# Altium schematic sheet LEDs.SchDoc
size A3; SheetNumber: 1; SheetTotal: 2
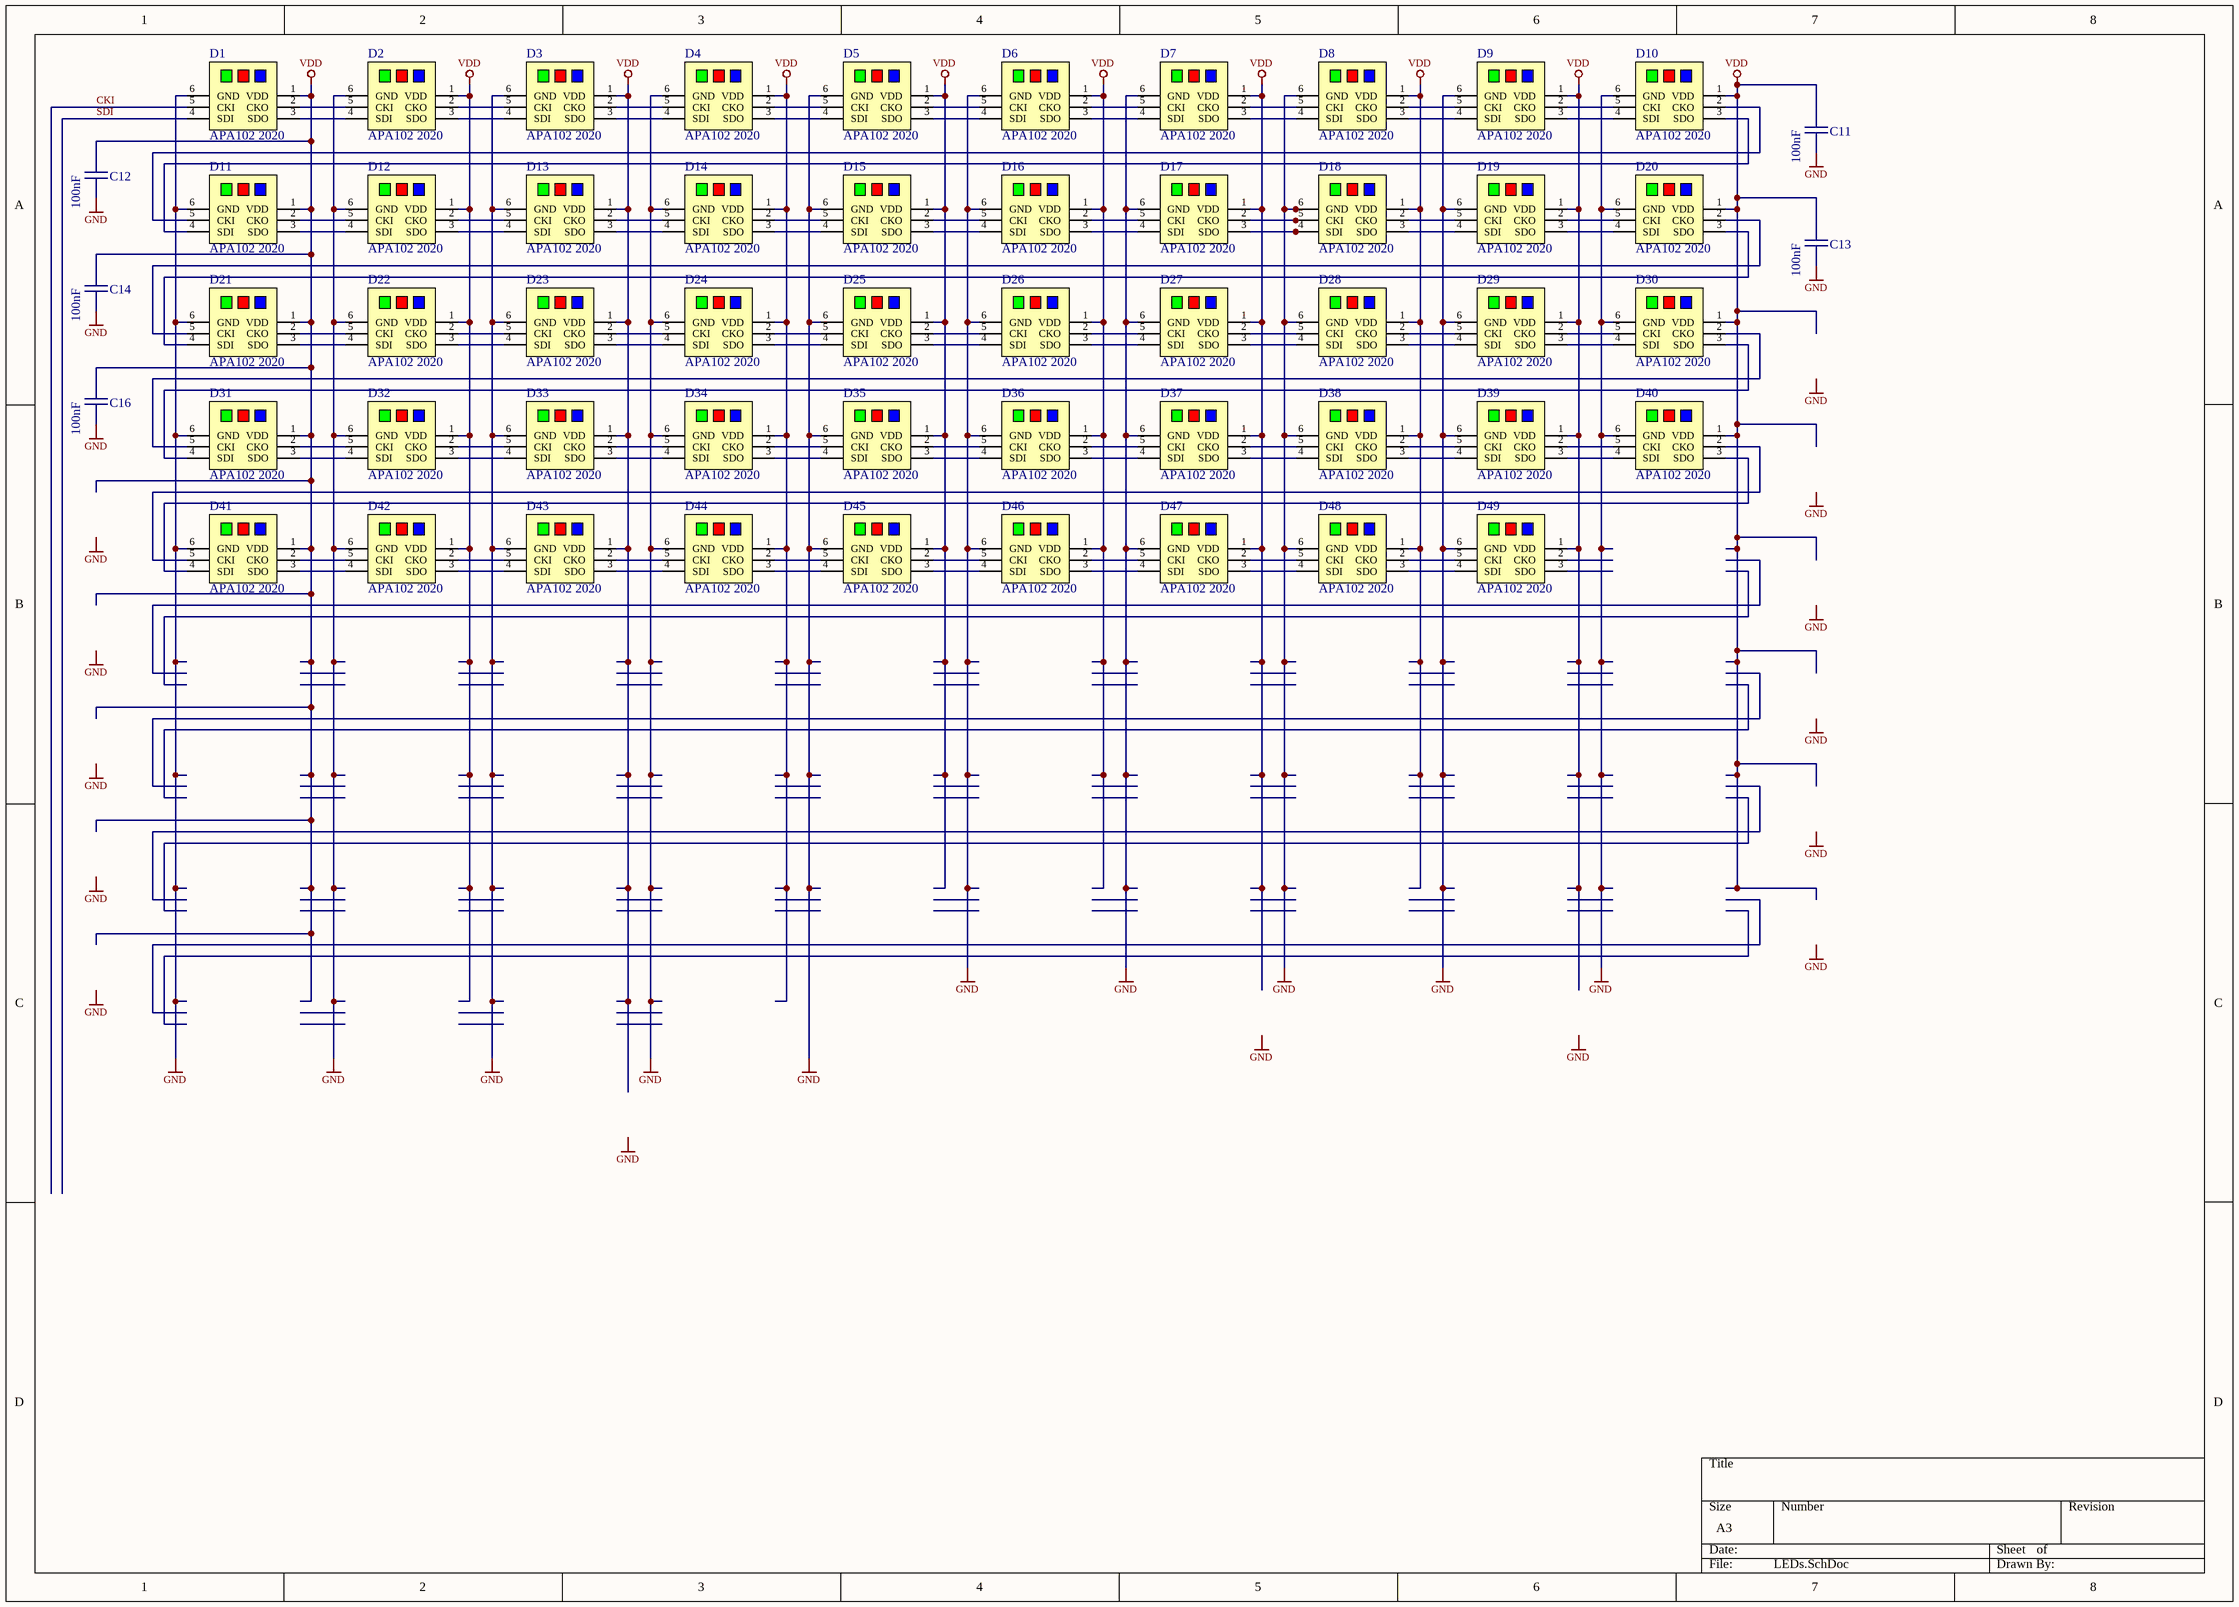
[diagram p0: LEDs.SchDoc]

## Parts
C11  100nF  [CAPC0603(1608)55_N]
C12  100nF  [CAPC0603(1608)55_N]
C13  100nF  [CAPC0603(1608)55_N]
C14  100nF  [CAPC0603(1608)55_N]
C16  100nF  [CAPC0603(1608)55_N]
D1  APA102 2020  [APA_RGB_LED_2020]
D2  APA102 2020  [APA_RGB_LED_2020]
D3  APA102 2020  [APA_RGB_LED_2020]
D4  APA102 2020  [APA_RGB_LED_2020]
D5  APA102 2020  [APA_RGB_LED_2020]
D6  APA102 2020  [APA_RGB_LED_2020]
D7  APA102 2020  [APA_RGB_LED_2020]
D8  APA102 2020  [APA_RGB_LED_2020]
D9  APA102 2020  [APA_RGB_LED_2020]
D10  APA102 2020  [APA_RGB_LED_2020]
D11  APA102 2020  [APA_RGB_LED_2020]
D12  APA102 2020  [APA_RGB_LED_2020]
D13  APA102 2020  [APA_RGB_LED_2020]
D14  APA102 2020  [APA_RGB_LED_2020]
D15  APA102 2020  [APA_RGB_LED_2020]
D16  APA102 2020  [APA_RGB_LED_2020]
D17  APA102 2020  [APA_RGB_LED_2020]
D18  APA102 2020  [APA_RGB_LED_2020]
D19  APA102 2020  [APA_RGB_LED_2020]
D20  APA102 2020  [APA_RGB_LED_2020]
D21  APA102 2020  [APA_RGB_LED_2020]
D22  APA102 2020  [APA_RGB_LED_2020]
D23  APA102 2020  [APA_RGB_LED_2020]
D24  APA102 2020  [APA_RGB_LED_2020]
D25  APA102 2020  [APA_RGB_LED_2020]
D26  APA102 2020  [APA_RGB_LED_2020]
D27  APA102 2020  [APA_RGB_LED_2020]
D28  APA102 2020  [APA_RGB_LED_2020]
D29  APA102 2020  [APA_RGB_LED_2020]
D30  APA102 2020  [APA_RGB_LED_2020]
D31  APA102 2020  [APA_RGB_LED_2020]
D32  APA102 2020  [APA_RGB_LED_2020]
D33  APA102 2020  [APA_RGB_LED_2020]
D34  APA102 2020  [APA_RGB_LED_2020]
D35  APA102 2020  [APA_RGB_LED_2020]
D36  APA102 2020  [APA_RGB_LED_2020]
D37  APA102 2020  [APA_RGB_LED_2020]
D38  APA102 2020  [APA_RGB_LED_2020]
D39  APA102 2020  [APA_RGB_LED_2020]
D40  APA102 2020  [APA_RGB_LED_2020]
D41  APA102 2020  [APA_RGB_LED_2020]
D42  APA102 2020  [APA_RGB_LED_2020]
D43  APA102 2020  [APA_RGB_LED_2020]
D44  APA102 2020  [APA_RGB_LED_2020]
D45  APA102 2020  [APA_RGB_LED_2020]
D46  APA102 2020  [APA_RGB_LED_2020]
D47  APA102 2020  [APA_RGB_LED_2020]
D48  APA102 2020  [APA_RGB_LED_2020]
D49  APA102 2020  [APA_RGB_LED_2020]

## Nets
GND: C11.1 C12.1 C13.1 C14.1 C16.1 D1.6(GND) D2.6(GND) D3.6(GND) D4.6(GND) D5.6(GND) D6.6(GND) D7.6(GND) D8.6(GND) D9.6(GND) D10.6(GND) D11.6(GND) D12.6(GND) D13.6(GND) D14.6(GND) D15.6(GND) D16.6(GND) D17.6(GND) D18.6(GND) D19.6(GND) D20.6(GND) D21.6(GND) D22.6(GND) D23.6(GND) D24.6(GND) D25.6(GND) D26.6(GND) D27.6(GND) D28.6(GND) D29.6(GND) D30.6(GND) D31.6(GND) D32.6(GND) D33.6(GND) D34.6(GND) D35.6(GND) D36.6(GND) D37.6(GND) D38.6(GND) D39.6(GND) D40.6(GND) D41.6(GND) D42.6(GND) D43.6(GND) D44.6(GND) D45.6(GND) D46.6(GND) D47.6(GND) D48.6(GND) D49.6(GND)
VDD: C11.2 C12.2 C13.2 C14.2 C16.2 D1.1(VDD) D2.1(VDD) D3.1(VDD) D4.1(VDD) D5.1(VDD) D6.1(VDD) D7.1(VDD) D8.1(VDD) D9.1(VDD) D10.1(VDD) D11.1(VDD) D12.1(VDD) D13.1(VDD) D14.1(VDD) D15.1(VDD) D16.1(VDD) D17.1(VDD) D18.1(VDD) D19.1(VDD) D20.1(VDD) D21.1(VDD) D22.1(VDD) D23.1(VDD) D24.1(VDD) D25.1(VDD) D26.1(VDD) D27.1(VDD) D28.1(VDD) D29.1(VDD) D30.1(VDD) D31.1(VDD) D32.1(VDD) D33.1(VDD) D34.1(VDD) D35.1(VDD) D36.1(VDD) D37.1(VDD) D38.1(VDD) D39.1(VDD) D40.1(VDD) D41.1(VDD) D42.1(VDD) D43.1(VDD) D44.1(VDD) D45.1(VDD) D46.1(VDD) D47.1(VDD) D48.1(VDD) D49.1(VDD)
CKI: D1.5(CKI)
SDI: D1.4(SDI)
NetD1_2: D1.2(CKO) D2.5(CKI)
NetD1_3: D1.3(SDO) D2.4(SDI)
NetD2_2: D2.2(CKO) D3.5(CKI)
NetD2_3: D2.3(SDO) D3.4(SDI)
NetD3_2: D3.2(CKO) D4.5(CKI)
NetD3_3: D3.3(SDO) D4.4(SDI)
NetD4_2: D4.2(CKO) D5.5(CKI)
NetD4_3: D4.3(SDO) D5.4(SDI)
NetD5_2: D5.2(CKO) D6.5(CKI)
NetD5_3: D5.3(SDO) D6.4(SDI)
NetD6_2: D6.2(CKO) D7.5(CKI)
NetD6_3: D6.3(SDO) D7.4(SDI)
NetD7_2: D7.2(CKO) D8.5(CKI)
NetD7_3: D7.3(SDO) D8.4(SDI)
NetD8_2: D8.2(CKO) D9.5(CKI)
NetD8_3: D8.3(SDO) D9.4(SDI)
NetD9_2: D9.2(CKO) D10.5(CKI)
NetD9_3: D9.3(SDO) D10.4(SDI)
NetD10_2: D10.2(CKO) D11.5(CKI)
NetD10_3: D10.3(SDO) D11.4(SDI)
NetD11_2: D11.2(CKO) D12.5(CKI)
NetD11_3: D11.3(SDO) D12.4(SDI)
NetD12_2: D12.2(CKO) D13.5(CKI)
NetD12_3: D12.3(SDO) D13.4(SDI)
NetD13_2: D13.2(CKO) D14.5(CKI)
NetD13_3: D13.3(SDO) D14.4(SDI)
NetD14_2: D14.2(CKO) D15.5(CKI)
NetD14_3: D14.3(SDO) D15.4(SDI)
NetD15_2: D15.2(CKO) D16.5(CKI)
NetD15_3: D15.3(SDO) D16.4(SDI)
NetD16_2: D16.2(CKO) D17.5(CKI)
NetD16_3: D16.3(SDO) D17.4(SDI)
NetD17_2: D17.2(CKO) D18.5(CKI)
NetD17_3: D17.3(SDO) D18.4(SDI)
NetD18_2: D18.2(CKO) D19.5(CKI)
NetD18_3: D18.3(SDO) D19.4(SDI)
NetD19_2: D19.2(CKO) D20.5(CKI)
NetD19_3: D19.3(SDO) D20.4(SDI)
NetD20_2: D20.2(CKO) D21.5(CKI)
NetD20_3: D20.3(SDO) D21.4(SDI)
NetD21_2: D21.2(CKO) D22.5(CKI)
NetD21_3: D21.3(SDO) D22.4(SDI)
NetD22_2: D22.2(CKO) D23.5(CKI)
NetD22_3: D22.3(SDO) D23.4(SDI)
NetD23_2: D23.2(CKO) D24.5(CKI)
NetD23_3: D23.3(SDO) D24.4(SDI)
NetD24_2: D24.2(CKO) D25.5(CKI)
NetD24_3: D24.3(SDO) D25.4(SDI)
NetD25_2: D25.2(CKO) D26.5(CKI)
NetD25_3: D25.3(SDO) D26.4(SDI)
NetD26_2: D26.2(CKO) D27.5(CKI)
NetD26_3: D26.3(SDO) D27.4(SDI)
NetD27_2: D27.2(CKO) D28.5(CKI)
NetD27_3: D27.3(SDO) D28.4(SDI)
NetD28_2: D28.2(CKO) D29.5(CKI)
NetD28_3: D28.3(SDO) D29.4(SDI)
NetD29_2: D29.2(CKO) D30.5(CKI)
NetD29_3: D29.3(SDO) D30.4(SDI)
NetD30_2: D30.2(CKO) D31.5(CKI)
NetD30_3: D30.3(SDO) D31.4(SDI)
NetD31_2: D31.2(CKO) D32.5(CKI)
NetD31_3: D31.3(SDO) D32.4(SDI)
NetD32_2: D32.2(CKO) D33.5(CKI)
NetD32_3: D32.3(SDO) D33.4(SDI)
NetD33_2: D33.2(CKO) D34.5(CKI)
NetD33_3: D33.3(SDO) D34.4(SDI)
NetD34_2: D34.2(CKO) D35.5(CKI)
NetD34_3: D34.3(SDO) D35.4(SDI)
NetD35_2: D35.2(CKO) D36.5(CKI)
NetD35_3: D35.3(SDO) D36.4(SDI)
NetD36_2: D36.2(CKO) D37.5(CKI)
NetD36_3: D36.3(SDO) D37.4(SDI)
NetD37_2: D37.2(CKO) D38.5(CKI)
NetD37_3: D37.3(SDO) D38.4(SDI)
NetD38_2: D38.2(CKO) D39.5(CKI)
NetD38_3: D38.3(SDO) D39.4(SDI)
NetD39_2: D39.2(CKO) D40.5(CKI)
NetD39_3: D39.3(SDO) D40.4(SDI)
NetD40_2: D40.2(CKO) D41.5(CKI)
NetD40_3: D40.3(SDO) D41.4(SDI)
NetD41_2: D41.2(CKO) D42.5(CKI)
NetD41_3: D41.3(SDO) D42.4(SDI)
NetD42_2: D42.2(CKO) D43.5(CKI)
NetD42_3: D42.3(SDO) D43.4(SDI)
NetD43_2: D43.2(CKO) D44.5(CKI)
NetD43_3: D43.3(SDO) D44.4(SDI)
NetD44_2: D44.2(CKO) D45.5(CKI)
NetD44_3: D44.3(SDO) D45.4(SDI)
NetD45_2: D45.2(CKO) D46.5(CKI)
NetD45_3: D45.3(SDO) D46.4(SDI)
NetD46_2: D46.2(CKO) D47.5(CKI)
NetD46_3: D46.3(SDO) D47.4(SDI)
NetD47_2: D47.2(CKO) D48.5(CKI)
NetD47_3: D47.3(SDO) D48.4(SDI)
NetD48_2: D48.2(CKO) D49.5(CKI)
NetD48_3: D48.3(SDO) D49.4(SDI)

Not connected (* = marked no-connect by the designer): D49 2(CKO) 3(SDO)

## Notes on the sheet
- Labels drawn without touching a wire or pin: GND

## Library data of the parts
C11-C14 C16 = 5152: pakke_opprettet_av: 815; leverandor_varenr: 1759122; pris: 1; nokkelord: Kondensator, Capacitor, CAP; pakketype: 0603; produsent: Multicomp; leverandor: Farnell; id: 5152; rad: 21; rom: OV; lager_type: Baklager; dybde: 0; antall: 985; beskrivelse: X7R 50V 5%; komponenttype: 2; navn: 100nF; pakke_opprettet: 18/02/2015 14:18:13; symbol_opprettet_av: 815; symbol_opprettet: 14/11/2014 20:19:34; hylle: 0; elektrisk_verdi: 100nF
D1-D49 = 5672: AdaFruit: 3341; id: 5672; pakke_opprettet_av: 815; beskrivelse: 2x2mm SMD RGB Addresserbar LED; leverandor_varenr: 1528-2392-ND; pris: 0; nokkelord: Adafruit: 3341; produsent: Kina; leverandor: DigiKey; pakketype: SMD; komponenttype: 9; DigiKey: 1528-2392-ND; pakke_opprettet: 08/02/2020 14:20:14; symbol_opprettet_av: 815; symbol_opprettet: 08/02/2020 14:20:38; navn: APA102 2020